# Altium project Boost_Contener_14.5V.PrjPcb
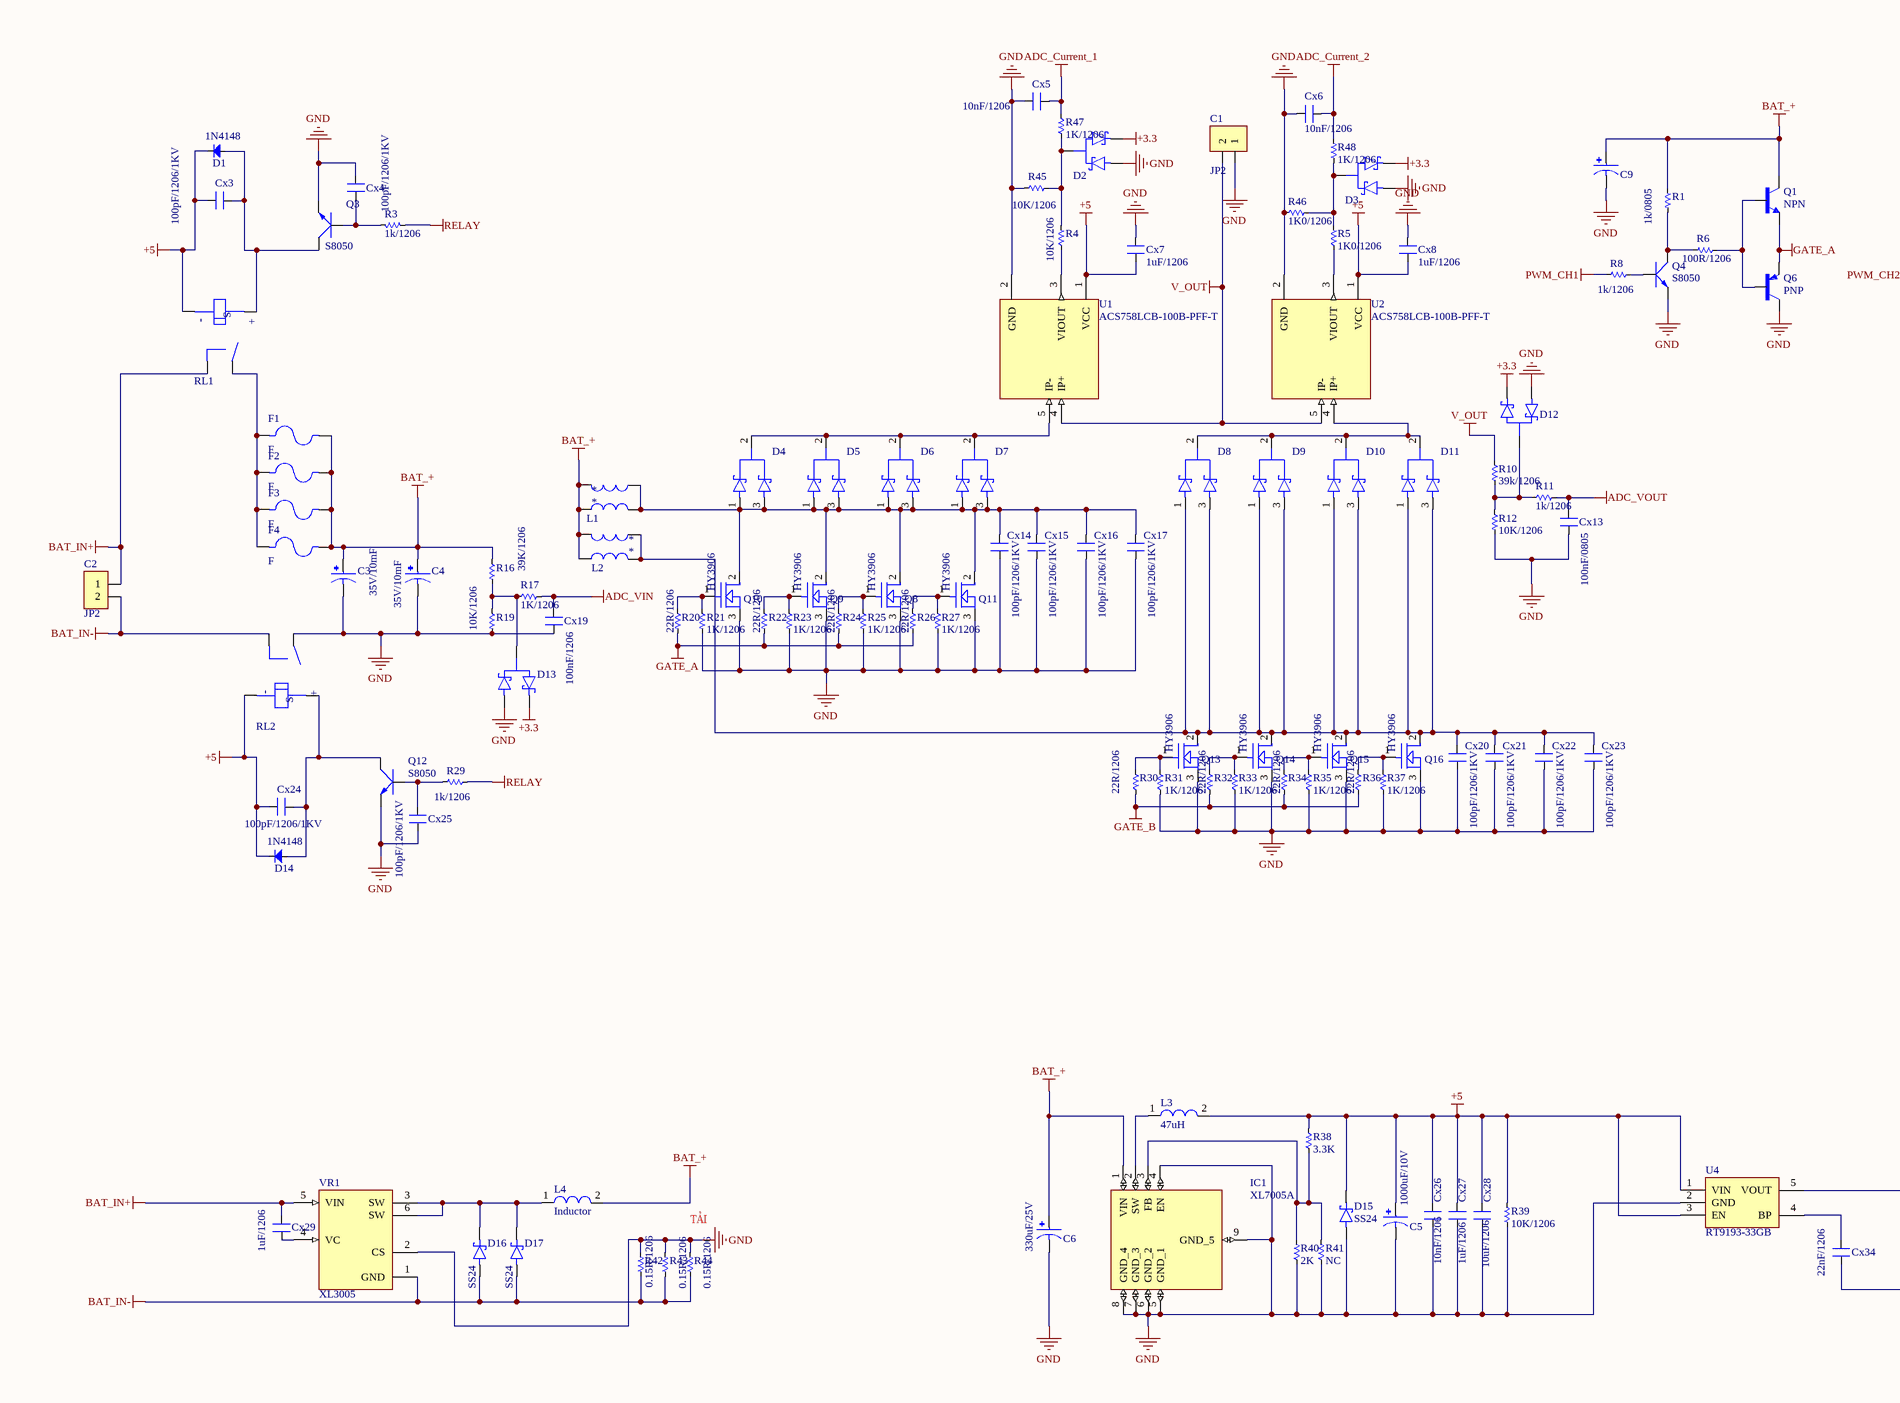
[diagram p0: Sche_Boost.SchDoc, left]
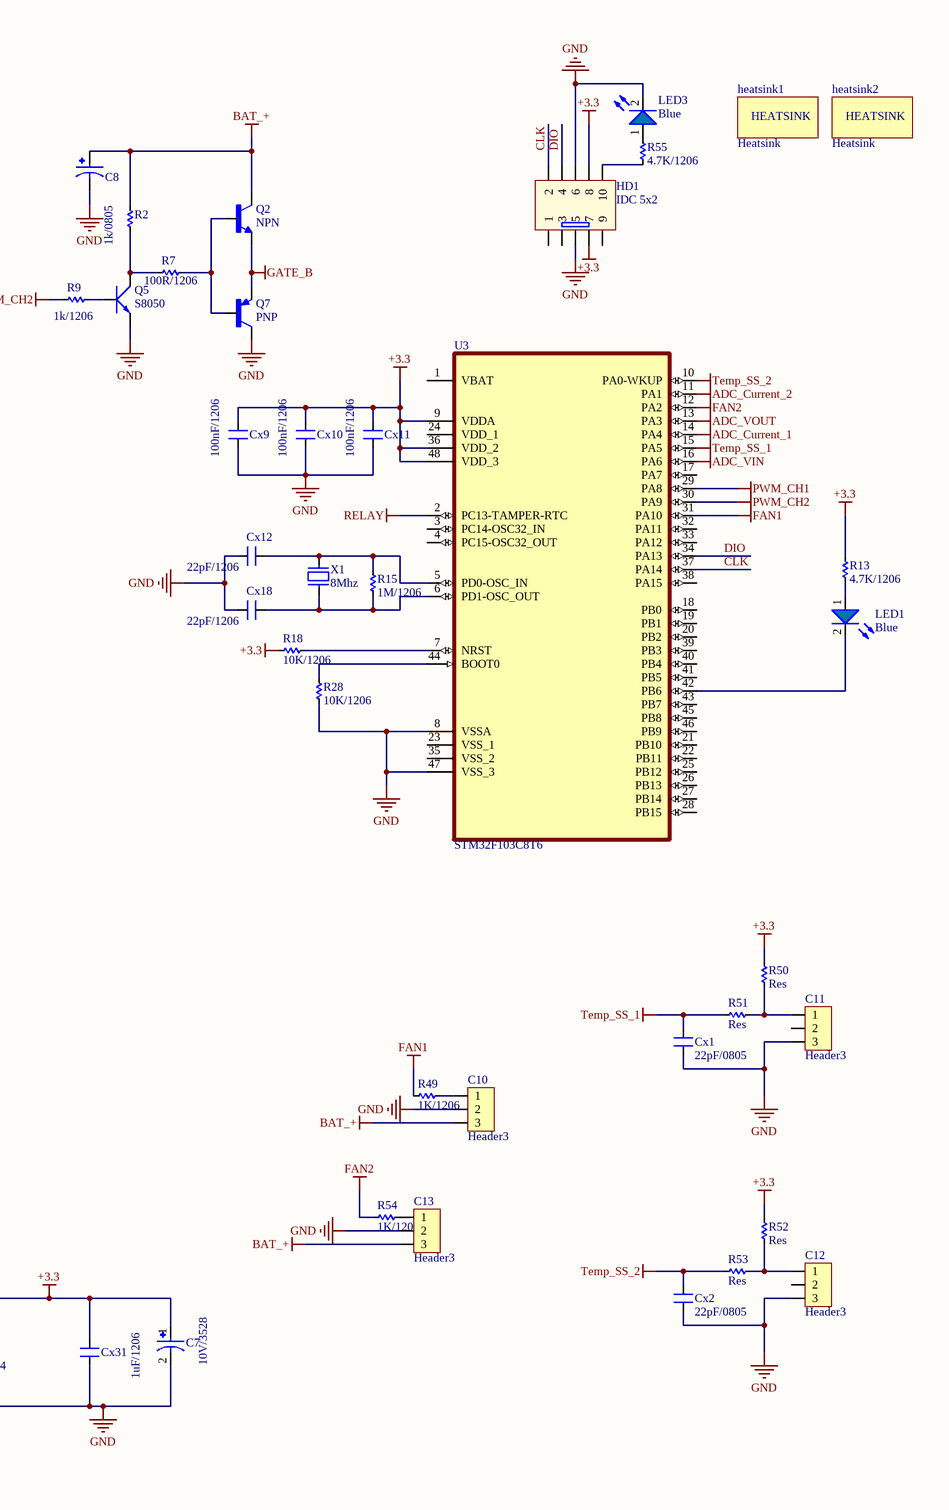
[diagram p1: Sche_Boost.SchDoc, right]
1 sheet, 153 parts. Net scope: global (net labels, ports and power ports of the same name join across sheets).
Board file: PCB_Boost.PcbDoc

## Sheet Sche_Boost.SchDoc
size A2; SheetNumber: 1; SheetTotal: 1

### Parts
C1  JP2  [JACK_DC_120A]
C2  JP2  [JACK_DC_120A]
C3  35V/10mF  [cAP-ALU-30x30mm]
C4  35V/10mF  [cAP-ALU-30x30mm]
C5  1000uF/10V  [Cap Alu 8x12mm]
C6  330uF/25V  [Cap Alu 8x12mm]
C7  10V/3528  [TANTALUM 3528]
C8  Cap  [Cap Alu 5.0x5.4mm]  (value not drawn)
C9  Cap  [Cap Alu 5.0x5.4mm]  (value not drawn)
C10  Header3  [Header3]
C11  Header3  [Header3]
C12  Header3  [Header3]
C13  Header3  [Header3]
Cx1  22pF/0805  [CN-SMD-1206]
Cx2  22pF/0805  [CN-SMD-1206]
Cx3  100pF/1206/1KV  [CN-SMD-1206]
Cx4  100pF/1206/1KV  [CN-SMD-0805]
Cx5  10nF/1206  [CN-SMD-1206]
Cx6  10nF/1206  [CN-SMD-1206]
Cx7  1uF/1206  [CN-SMD-1206]
Cx8  1uF/1206  [CN-SMD-1206]
Cx9  100nF/1206  [CN-SMD-1206]
Cx10  100nF/1206  [CN-SMD-1206]
Cx11  100nF/1206  [CN-SMD-1206]
Cx12  22pF/1206  [CN-SMD-1206]
Cx13  100nF/0805  [CN-SMD-1206]
Cx14  100pF/1206/1KV  [CN-SMD-1206]
Cx15  100pF/1206/1KV  [CN-SMD-1206]
Cx16  100pF/1206/1KV  [CN-SMD-1206]
Cx17  100pF/1206/1KV  [CN-SMD-1206]
Cx18  22pF/1206  [CN-SMD-1206]
Cx19  100nF/1206  [CN-SMD-1206]
Cx20  100pF/1206/1KV  [CN-SMD-1206]
Cx21  100pF/1206/1KV  [CN-SMD-1206]
Cx22  100pF/1206/1KV  [CN-SMD-1206]
Cx23  100pF/1206/1KV  [CN-SMD-1206]
Cx24  100pF/1206/1KV  [CN-SMD-1206]
Cx25  100pF/1206/1KV  [CN-SMD-0805]
Cx26  10nF/1206  [CN-SMD-1206]
Cx27  1uF/1206  [CN-SMD-1206]
Cx28  10uF/1206  [CN-SMD-1206]
Cx29  1uF/1206  [CN-SMD-0805]
Cx31  1uF/1206  [CN-SMD-1206]
Cx34  22nF/1206  [CN-SMD-1206]
D1  1N4148  [1N4148_SMD]
D2  10A/200V  [SOT23-3-2-1-BCE]  (value not drawn)
D3  10A/200V  [SOT23-3-2-1-BCE]  (value not drawn)
D4  Diode schottky  [TO-220]  (value not drawn)
D5  Diode schottky  [TO-220]  (value not drawn)
D6  Diode schottky  [TO-220]  (value not drawn)
D7  Diode schottky  [TO-220]  (value not drawn)
D8  Diode schottky  [TO-220]  (value not drawn)
D9  Diode schottky  [TO-220]  (value not drawn)
D10  Diode schottky  [TO-220]  (value not drawn)
D11  Diode schottky  [TO-220]  (value not drawn)
D12  10A/200V  [SOT23-3-2-1-BCE]  (value not drawn)
D13  BAV99  [SOT23-3-2-1-BCE]  (value not drawn)
D14  1N4148  [1N4148_SMD]
D15  SS24  [SS24]
D16  SS24  [SS24]
D17  SS24  [SS24]
F1  F  [FUSE-Blade]
F2  F  [FUSE-Blade]
F3  F  [FUSE-Blade]
F4  F  [FUSE-Blade]
HD1  IDC 5x2  [IDC10]
heatsink1  Heatsink  [HeatSink_200x47mm]
heatsink2  Heatsink  [HeatSink_200x47mm]
IC1  XL7005A  [SOIC127P600X175-9N]
L1  coupled inductor  [L-DIP-2CORE-BRANCH]  (value not drawn)
L2  coupled inductor  [L-DIP-2CORE-BRANCH]  (value not drawn)
L3  47uH  [L-SMD-IRON]
L4  Inductor  [Inductor 10mmx10mm]
LED1  value Blue  [LED-0805-Blue]  (hidden comment: LED-Blue)
LED3  value Blue  [LED-0805-Blue]  (hidden comment: 4.7K/1206)
Q1  NPN  [SOT89]
Q2  NPN  [SOT89]
Q3  S8050  [SOT23-3-2-1-BCE]
Q4  S8050  [SOT23-3-2-1-BCE]
Q5  S8050  [SOT23-3-2-1-BCE]
Q6  PNP  [SOT89]
Q7  PNP  [SOT89]
Q8  HY3906  [TO-220-Tamgiac]
Q9  HY3906  [TO-220-Tamgiac]
Q10  HY3906  [TO-220-Tamgiac]
Q11  HY3906  [TO-220-Tamgiac]
Q12  S8050  [SOT23-3-2-1-BCE]
Q13  HY3906  [TO-220-Tamgiac]
Q14  HY3906  [TO-220-Tamgiac]
Q15  HY3906  [TO-220-Tamgiac]
Q16  HY3906  [TO-220-Tamgiac]
R1  1k/0805  [RES-SMD-1206]
R2  1k/0805  [RES-SMD-1206]
R3  1k/1206  [RES-SMD-1206]
R4  10K/1206  [RES-SMD-1206]
R5  1K0/1206  [RES-SMD-1206]
R6  100R/1206  [RES-SMD-1206]
R7  100R/1206  [RES-SMD-1206]
R8  1k/1206  [RES-SMD-1206]
R9  1k/1206  [RES-SMD-1206]
R10  39k/1206  [RES-SMD-1206]
R11  1k/1206  [RES-SMD-1206]
R12  10K/1206  [RES-SMD-1206]
R13  4.7K/1206  [RES-SMD-1206]
R15  1M/1206  [RES-SMD-1206]
R16  39K/1206  [RES-SMD-1206]
R17  1K/1206  [RES-SMD-1206]
R18  10K/1206  [RES-SMD-1206]
R19  10K/1206  [RES-SMD-1206]
R20  22R/1206  [RES-SMD-1206]
R21  1K/1206  [RES-SMD-1206]
R22  22R/1206  [RES-SMD-1206]
R23  1K/1206  [RES-SMD-1206]
R24  22R/1206  [RES-SMD-1206]
R25  1K/1206  [RES-SMD-1206]
R26  22R/1206  [RES-SMD-1206]
R27  1K/1206  [RES-SMD-1206]
R28  10K/1206  [RES-SMD-1206]
R29  1k/1206  [RES-SMD-1206]
R30  22R/1206  [RES-SMD-1206]
R31  1K/1206  [RES-SMD-1206]
R32  22R/1206  [RES-SMD-1206]
R33  1K/1206  [RES-SMD-1206]
R34  22R/1206  [RES-SMD-1206]
R35  1K/1206  [RES-SMD-1206]
R36  22R/1206  [RES-SMD-1206]
R37  1K/1206  [RES-SMD-1206]
R38  3.3K  [RES-SMD-1206]
R39  10K/1206  [RES-SMD-1206]
R40  2K  [RES-SMD-1206]
R41  NC  [RES-SMD-1206]
R42  0.15R/1206  [RES-SMD-1206]
R43  0.15R/1206  [RES-SMD-1206]
R44  0.15R/1206  [RES-SMD-1206]
R45  10K/1206  [RES-SMD-1206]
R46  1K0/1206  [RES-SMD-1206]
R47  1K/1206  [RES-SMD-1206]
R48  1K/1206  [RES-SMD-1206]
R49  1K/1206  [RES-SMD-1206]
R50  Res  [RES-SMD-1206]
R51  Res  [RES-SMD-1206]
R52  Res  [RES-SMD-1206]
R53  Res  [RES-SMD-1206]
R54  1K/1206  [RES-SMD-1206]
R55  4.7K/1206  [RES-SMD-1206]
RL1  Relay YL-368-A  [Relay YL368-A]  (value not drawn)
RL2  Relay YL-368-A  [Relay YL368-A]  (value not drawn)
U1  ACS758LCB-100B-PFF-T  [ACS578xx]
U2  ACS758LCB-100B-PFF-T  [ACS578xx]
U3  STM32F103C8T6  [QFP50P900X900X160-48N]
U4  RT9193-33GB  [SOT94P279X129-5N]
VR1  XL3005  [TO-263_L]
X1  8Mhz  [XT2]

### Nets
+3.3: C7.1 Cx9.2 Cx10.2 Cx11.2 Cx31.2 D2.2(A) D3.2(A) D12.2(A) D13.2(A) HD1.7 HD1.8 R13.2 R18.2 R50.2 R52.2 U3.9(VDDA) U3.36(VDD_2) U3.48(VDD_3) U4.5(VOUT)
+5: C5.1 Cx3.2 Cx7.2 Cx8.2 Cx24.2 Cx26.2 Cx27.2 Cx28.2 D1.2(K) D14.2(K) D15.2(K) L3.2 R38.1 R39.1 RL1.2 RL2.2 U1.1(VCC) U2.1(VCC) U4.1(VIN) U4.3(EN)
ADC_Current_1: Cx5.2 R47.1 U3.14(PA4)
ADC_Current_2: Cx6.2 R48.1 U3.11(PA1)
ADC_VIN: Cx19.1 R17.1 U3.16(PA6)
ADC_VOUT: Cx13.1 R11.1 U3.13(PA3)
BAT_+: C3.1 C4.1 C6.1 C8.1 C9.1 C10.3 C13.3 F1.2 F2.2 F3.2 F4.2 IC1.1(VIN) L1.3 L1.4 L2.1 L2.2 L4.2 Q1.2(C) Q2.2(C) R1.2 R2.2 R16.2
BAT_IN+: C2.1 Cx29.2 RL1.3 VR1.5(VIN)
BAT_IN-: C2.2 D16.1(A) D17.1(A) R42.2 R43.2 R44.2 RL2.3 VR1.1(GND)
FAN1: R49.1 U3.31(PA10)
FAN2: R54.1 U3.12(PA2)
GATE_A: Q1.3(E) Q6.3(E) R20.1 R22.1 R24.1 R26.1
GATE_B: Q2.3(E) Q7.3(E) R30.1 R32.1 R34.1 R36.1
GND: C1.1 C3.2 C4.2 C5.2 C6.2 C7.2 C8.2 C9.2 C10.2 C11.3 C12.3 C13.2 Cx1.2 Cx2.2 Cx4.2 Cx5.1 Cx6.1 Cx7.1 Cx8.1 Cx9.1 Cx10.1 Cx11.1 Cx12.2 Cx13.2 Cx14.1 Cx15.1 Cx16.1 Cx17.1 Cx18.2 Cx19.2 Cx20.1 Cx21.1 Cx22.1 Cx23.1 Cx25.2 Cx26.1 Cx27.1 Cx28.1 Cx31.1 Cx34.1 D2.1(A) D3.1(A) D12.1(A) D13.1(A) D15.1(A) HD1.5 HD1.6 IC1.4(EN) IC1.5(GND_1) IC1.6(GND_2) IC1.7(GND_3) IC1.8(GND_4) IC1.9(GND_5) LED3.2(K) Q3.1(E) Q4.1(E) Q5.1(E) Q6.2(C) Q7.2(C) Q8.3(S) Q9.3(S) Q10.3(S) Q11.3(S) Q12.1(E) Q13.3(S) Q14.3(S) Q15.3(S) Q16.3(S) R12.1 R19.1 R21.1 R23.1 R25.1 R27.1 R28.1 R31.1 R33.1 R35.1 R37.1 R39.2 R40.2 R41.2 R42.1 R43.1 R44.1 R45.2 R46.2 RL2.4 U1.2(GND) U2.2(GND) U3.8(VSSA) U3.47(VSS_3) U4.2(GND) VR1.2(CS)
PWM_CH1: R8.1 U3.29(PA8)
PWM_CH2: R9.1 U3.30(PA9)
RELAY: R3.2 R29.2 U3.2(PC13-TAMPER-RTC)
Temp_SS_1: Cx1.1 R51.2 U3.15(PA5)
Temp_SS_2: Cx2.1 R53.2 U3.10(PA0-WKUP)
V_OUT: C1.2 R10.2 U1.4(IP+) U2.5(IP-)
CLK: HD1.2 U3.37(PA14)
DIO: HD1.4 U3.34(PA13)
NetC10_1: C10.1 R49.2
NetC11_1: C11.1 R50.1 R51.1
NetC12_1: C12.1 R52.1 R53.1
NetC13_1: C13.1 R54.2
NetCx3_1: Cx3.1 D1.1(A) Q3.2(C) RL1.1
NetCx4_1: Cx4.1 Q3.3(B) R3.1
NetCx12_1: Cx12.1 R15.1 U3.5(PD0-OSC_IN) X1.1
NetCx14_2: Cx14.2 Cx15.2 Cx16.2 Cx17.2 D4.1(A1) D4.3(A3) D5.1(A1) D5.3(A3) D6.1(A1) D6.3(A3) D7.1(A1) D7.3(A3) L1.1 L1.2 Q8.2(D) Q9.2(D) Q10.2(D) Q11.2(D)
NetCx18_1: Cx18.1 R15.2 U3.6(PD1-OSC_OUT) X1.2
NetCx20_2: Cx20.2 Cx21.2 Cx22.2 Cx23.2 D8.1(A1) D8.3(A3) D9.1(A1) D9.3(A3) D10.1(A1) D10.3(A3) D11.1(A1) D11.3(A3) L2.3 L2.4 Q13.2(D) Q14.2(D) Q15.2(D) Q16.2(D)
NetCx24_1: Cx24.1 D14.1(A) Q12.2(C) RL2.1
NetCx25_1: Cx25.1 Q12.3(B) R29.1
NetCx29_1: Cx29.1 VR1.4(VC)
NetCx34_2: Cx34.2 U4.4(BP)
NetD2_3: D2.3(AK) R4.2 R45.1 R47.2
NetD3_3: D3.3(AK) R5.2 R46.1 R48.2
NetD4_2: D4.2(K) D5.2(K) D6.2(K) D7.2(K) U1.5(IP-)
NetD8_2: D8.2(K) D9.2(K) D10.2(K) D11.2(K) U2.4(IP+)
NetD12_3: D12.3(AK) R10.1 R11.2 R12.2
NetD13_3: D13.3(AK) R16.1 R17.2 R19.2
NetD16_2: D16.2(K) D17.2(K) L4.1 VR1.3(SW) VR1.6(SW)
NetF1_1: F1.1 F2.1 F3.1 F4.1 RL1.4
NetHD1_10: HD1.10 R55.2
NetIC1_2: IC1.2(SW) L3.1
NetIC1_3: IC1.3(FB) R38.2 R40.1 R41.1
NetLED1_1: LED1.1(A) R13.1
NetLED1_2: LED1.2(K) U3.42(PB6)
NetLED3_1: LED3.1(A) R55.1
NetQ1_1: Q1.1(B) Q6.1(B) R6.2
NetQ2_1: Q2.1(B) Q7.1(B) R7.2
NetQ4_2: Q4.2(C) R1.1 R6.1
NetQ4_3: Q4.3(B) R8.2
NetQ5_2: Q5.2(C) R2.1 R7.1
NetQ5_3: Q5.3(B) R9.2
NetQ8_1: Q8.1(G) R24.2 R25.2
NetQ9_1: Q9.1(G) R22.2 R23.2
NetQ10_1: Q10.1(G) R20.2 R21.2
NetQ11_1: Q11.1(G) R26.2 R27.2
NetQ13_1: Q13.1(G) R30.2 R31.2
NetQ14_1: Q14.1(G) R32.2 R33.2
NetQ15_1: Q15.1(G) R34.2 R35.2
NetQ16_1: Q16.1(G) R36.2 R37.2
NetR4_1: R4.1 U1.3(VIOUT)
NetR5_1: R5.1 U2.3(VIOUT)
NetR18_1: R18.1 U3.7(NRST)
NetR28_2: R28.2 U3.44(BOOT0)

Not connected (* = marked no-connect by the designer): C11 2; C12 2; HD1 1 3 9; U3 1(VBAT) 3(PC14-OSC32_IN) 4(PC15-OSC32_OUT) 17(PA7) 18(PB0) 19(PB1) 20(PB2) 21(PB10) 22(PB11) 23(VSS_1) 24(VDD_1) 25(PB12) 26(PB13) 27(PB14) 28(PB15) 32(PA11) 33(PA12) 35(VSS_2) 38(PA15) 39(PB3) 40(PB4) 41(PB5) 43(PB7) 45(PB8) 46(PB9)

### Notes on the sheet
- TẢI
- (in symbol Heatsink) HEATSINK
- (in symbol Relay YL-368-A) -; +; S

### Library data of the parts
C1 C2 = JP2: WR-PHD 2.54 mm Angled Socket Header; Manufacturer: W¨¹rth Elektronik eiSos GmbH; partNo: 613002143121; ComponentLink1 Description: Manufacturer; ComponentLink2 Description: Datasheet; NoPins: 02; Created Date: 29 March 2013; ComponentLink1URL: http://www.we-online.com; ComponentLink2URL: http://katalog.we-online.de/em/datasheet/6130xx143121.pdf; Created by: Karrer Zheng
C3 C4 = CAP-ALU-DIP: https://linhkienchatluong.vn/tu-hoa-co-phan-cuc/tu-hoa-35v-10000uf-30x30mm-jccon-audio-chan-cung_sp454_ct14398.aspx; Value: 104; LatestRevisionDate: 17-Jul-2002; LatestRevisionNote: Re-released for DXP Platform.; PackageReference: C1206; Publisher: Altium Limited
C5 = Cap Alu: https://linhkienchatluong.vn/tu-nhom---tu-hoa-dan/tu-nhom-10v-1000uf-8x10mm_sp455_ct956.aspx; MF: Panasonic; MP: EEEFN1A101UR; Package: RADIAL-2 Panasonic; Digi-Key_Part_Number: 10-EEE-FN1A101URCT-ND; Check_prices: https://www.snapeda.com/parts/EEEFN1A101UR/Panasonic/view-part/5785072/?ref=eda; Value: *; SnapEDA_Link: https://www.snapeda.com/parts/EEEFN1A101UR/Panasonic/view-part/5785072/?ref=snap
C6 = Cap Alu: https://linhkienchatluong.vn/tu-nhom---tu-hoa-dan/tu-nhom-25v-330uf-8x10mm_sp455_ct971.aspx; MF: Panasonic; MP: EEEFN1A101UR; Package: RADIAL-2 Panasonic; Digi-Key_Part_Number: 10-EEE-FN1A101URCT-ND; Check_prices: https://www.snapeda.com/parts/EEEFN1A101UR/Panasonic/view-part/5785072/?ref=eda; Value: *; SnapEDA_Link: https://www.snapeda.com/parts/EEEFN1A101UR/Panasonic/view-part/5785072/?ref=snap
C7 = Cap Tantalum: https://linhkienchatluong.vn/tu-tantalium/tu-tantalum-3528-107a-10v-100uf-35x28mm-tajb107m010rnj_sp460_ct1163.aspx; MP: T493C106K020BH6310; MF: Kemet; Availability: In Stock; Price: None; Package: SMD-2 Kemet; Value: *; SnapEDA_Link: https://www.snapeda.com/parts/T493C106K020BH6310/Kemet/view-part/?ref=snap; Check_prices: https://www.snapeda.com/parts/T493C106K020BH6310/Kemet/view-part/?ref=eda
C8 C9 = Cap Alu: CAP ALU SMD; MF: Panasonic; MP: EEEFN1A101UR; Package: RADIAL-2 Panasonic; Digi-Key_Part_Number: 10-EEE-FN1A101URCT-ND; Check_prices: https://www.snapeda.com/parts/EEEFN1A101UR/Panasonic/view-part/5785072/?ref=eda; Value: *; SnapEDA_Link: https://www.snapeda.com/parts/EEEFN1A101UR/Panasonic/view-part/5785072/?ref=snap
C10-C13 = Header3: https://linhkienchatluong.vn/header-xh254-trang/header-duc-3p-xh254-3p-chan-thang-10c_sp861_ct1712.aspx; Manufacturer: W¨¹rth Elektronik eiSos GmbH; partNo: 613002143121; ComponentLink1 Description: Manufacturer; ComponentLink2 Description: Datasheet; NoPins: 02; Created Date: 29 March 2013; ComponentLink1URL: http://www.we-online.com; ComponentLink2URL: http://katalog.we-online.de/em/datasheet/6130xx143121.pdf; Created by: Karrer Zheng
Cx1-Cx29 Cx31 Cx34 = CN: Value: 33pF
D1 D14 = Diode: Default Diode; Code - JEDEC: DO-214-AB; Value: 1N5007; Published: 8-Jun-2000; Revision: July-2002: Re-released for DXP Platform.; Publisher: Altium Limited
D2 D3 D12 D13 = Diode Dual Serial
D4-D11 = MBRF20200CT: Package: None; Price: None; Value: *; MP: MBRF20200CT; Availability: Unavailable
D15-D17 = SS24: Diode Schottky 40V 2A Surface Mount DO-214AA (SMB); MF: ON Semiconductor; Package: DO-214AA ON Semiconductor; Price: None; Value: *; SnapEDA_Link: https://www.snapeda.com/parts/SS24/Onsemi/view-part/?ref=snap; MP: SS24; Availability: In Stock; Check_prices: https://www.snapeda.com/parts/SS24/Onsemi/view-part/?ref=eda
F1-F4 = FUSE 20x5
HD1 = IDC 5X2: Value: Header 5x2
IC1 = XL7005A: https://snapeda.s3.amazonaws.com/datasheet/XL7005A_datasheet-English.pdf; MF: XLSEMI; Package: Package; Price: None; Value: *; SnapEDA_Link: https://www.snapeda.com/parts/XL7005A/XLSEMI/view-part/?ref=snap; MP: XL7005A; Availability: Not in stock; Check_prices: https://www.snapeda.com/parts/XL7005A/XLSEMI/view-part/?ref=eda
L3 = Inductor_SMD
L4 = Inductor: Manufacturer_Name: Sumida; Manufacturer_Part_Number: CDRH104RNP-100NC; Datasheet Link: http://products.sumida.com/products/pdf/CDRH104R.pdf; Height: 4mm; Mouser Part Number: 851-CDRH104RNP-100NC; Mouser Price/Stock: https://www.mouser.co.uk/ProductDetail/Sumida/CDRH104RNP-100NC?qs=qsxNffVSAzE8lEZlJlwl9Q%3D%3D; Arrow Part Number: CDRH104RNP-100NC; Arrow Price/Stock: https://www.arrow.com/en/products/cdrh104rnp-100nc/sumida?region=nac
LED1 LED3 = LED-Blue: LED Blue 10mA 2.2v; ComponentLink1Description: Datasheet; ComponentLink1URL: D:\Dropbox\Datasheets\Opto and Illumination\LEDs\SMD LED.pdf; Unit Price: 0.0476
Q1 Q2 = TRANSISTOR NPN: MP: MJD31; MF: Motorola; SnapEDA_Link: https://www.snapeda.com/parts/MJD31/Motorola/view-part/565026/?ref=snap; Package: TO-252-3 Motorola; Value: *; Availability: Unavailable; Price: None
Q3-Q5 Q12 = S8050: NPN 600mW, ECB; Value: C1815
Q6 Q7 = TRANSISTOR PNP: MP: MJD31; MF: Motorola; SnapEDA_Link: https://www.snapeda.com/parts/MJD31/Motorola/view-part/565026/?ref=snap; Package: TO-252-3 Motorola; Value: *; Availability: Unavailable; Price: None
Q8-Q11 Q13-Q16 = MOSFET N: 60V/150A
R1-R13 R16 R17 R20 R22 R24 R26 R28 R29 R38-R55 = Res-SMD: Resistor; Manufacturer: Generic Components; Class: Passive; Published: 08/06/2000; Publisher: Altium Hobart Technology Centre
R15 R18 R19 R21 R23 R25 R27 R30-R37 = Res-SMD: Manufacturer: Generic Components; Class: Passive; Published: 08/06/2000; Publisher: Altium Hobart Technology Centre
U1 U2 = ACS758LCB-100B-PFF-T: Current Sensor 100A 1 Channel Hall Effect, Open Loop Bidirectional 5-CB Formed Leads, PFF; MF: Allegro; Price: None; Availability: In Stock; Package: 5-CB-5 Allegro MicroSystems LLC; MP: ACS758LCB-100B-PFF-T; Value: *; SnapEDA_Link: https://www.snapeda.com/parts/ACS758LCB-100B-PFF-T/Allegro+Industries/view-part/?ref=snap; Purchase-URL: https://pricing.snapeda.com/search/part/ACS758LCB-100B-PFF-T/?ref=eda; Check_prices: https://www.snapeda.com/parts/ACS758LCB-100B-PFF-T/Allegro+Industries/view-part/?ref=eda
U3 = STM32F103C8T7: ARMÂ® CortexÂ®-M3 STM32F1 Microcontroller IC 32-Bit 72MHz 64KB _64K x 8_ FLASH 48-LQFP _7x7_; MF: STMicroelectronics; Package: LQFP-48 STMicroelectronics; Value: *; Price: None; MP: STM32F103C8T7; Availability: Unavailable; SnapEDA_Link: https://www.snapeda.com/parts/STM32F103C8T7/STMicroelectronics/view-part/446939/?ref=snap
U4 = RT9193-33GB: Linear Voltage Regulator IC Positive Fixed 1 Output 300mA TSOT-23-5; MF: Richtek USA; SnapEDA_Link: https://www.snapeda.com/parts/RT9193-33GB/Richtek+USA+Inc./view-part/?ref=snap; Package: SOT-23-5 Richtek; MP: RT9193-33GB; Check_prices: https://www.snapeda.com/parts/RT9193-33GB/Richtek+USA+Inc./view-part/?ref=eda; Purchase-URL: https://pricing.snapeda.com/search/part/RT9193-33GB/?ref=eda; Digi-Key_Part_Number: 1028-1014-2-ND; Value: *
VR1 = XL3005: The XL3005 regulator is a wide input range, current mode, DC/DC converter which is capable of generating either positive or negative output voltages.; MF: XLSEMI; MP: XL6009; Package: TO-263-5L XLSEMI; Price: None; Value: *; SnapEDA_Link: https://www.snapeda.com/parts/XL6009/XLSEMI/view-part/?ref=snap; Availability: Not in stock; Check_prices: https://www.snapeda.com/parts/XL6009/XLSEMI/view-part/?ref=eda
X1 = XT2: Crystal, 32.768 KHz, -40 to 85 degC, 3.2 x 1.5 x 0.9 mm SMD; Value: 4Mhz